# EAGLE schematic universal atmega16 (EAGLE 5.04)
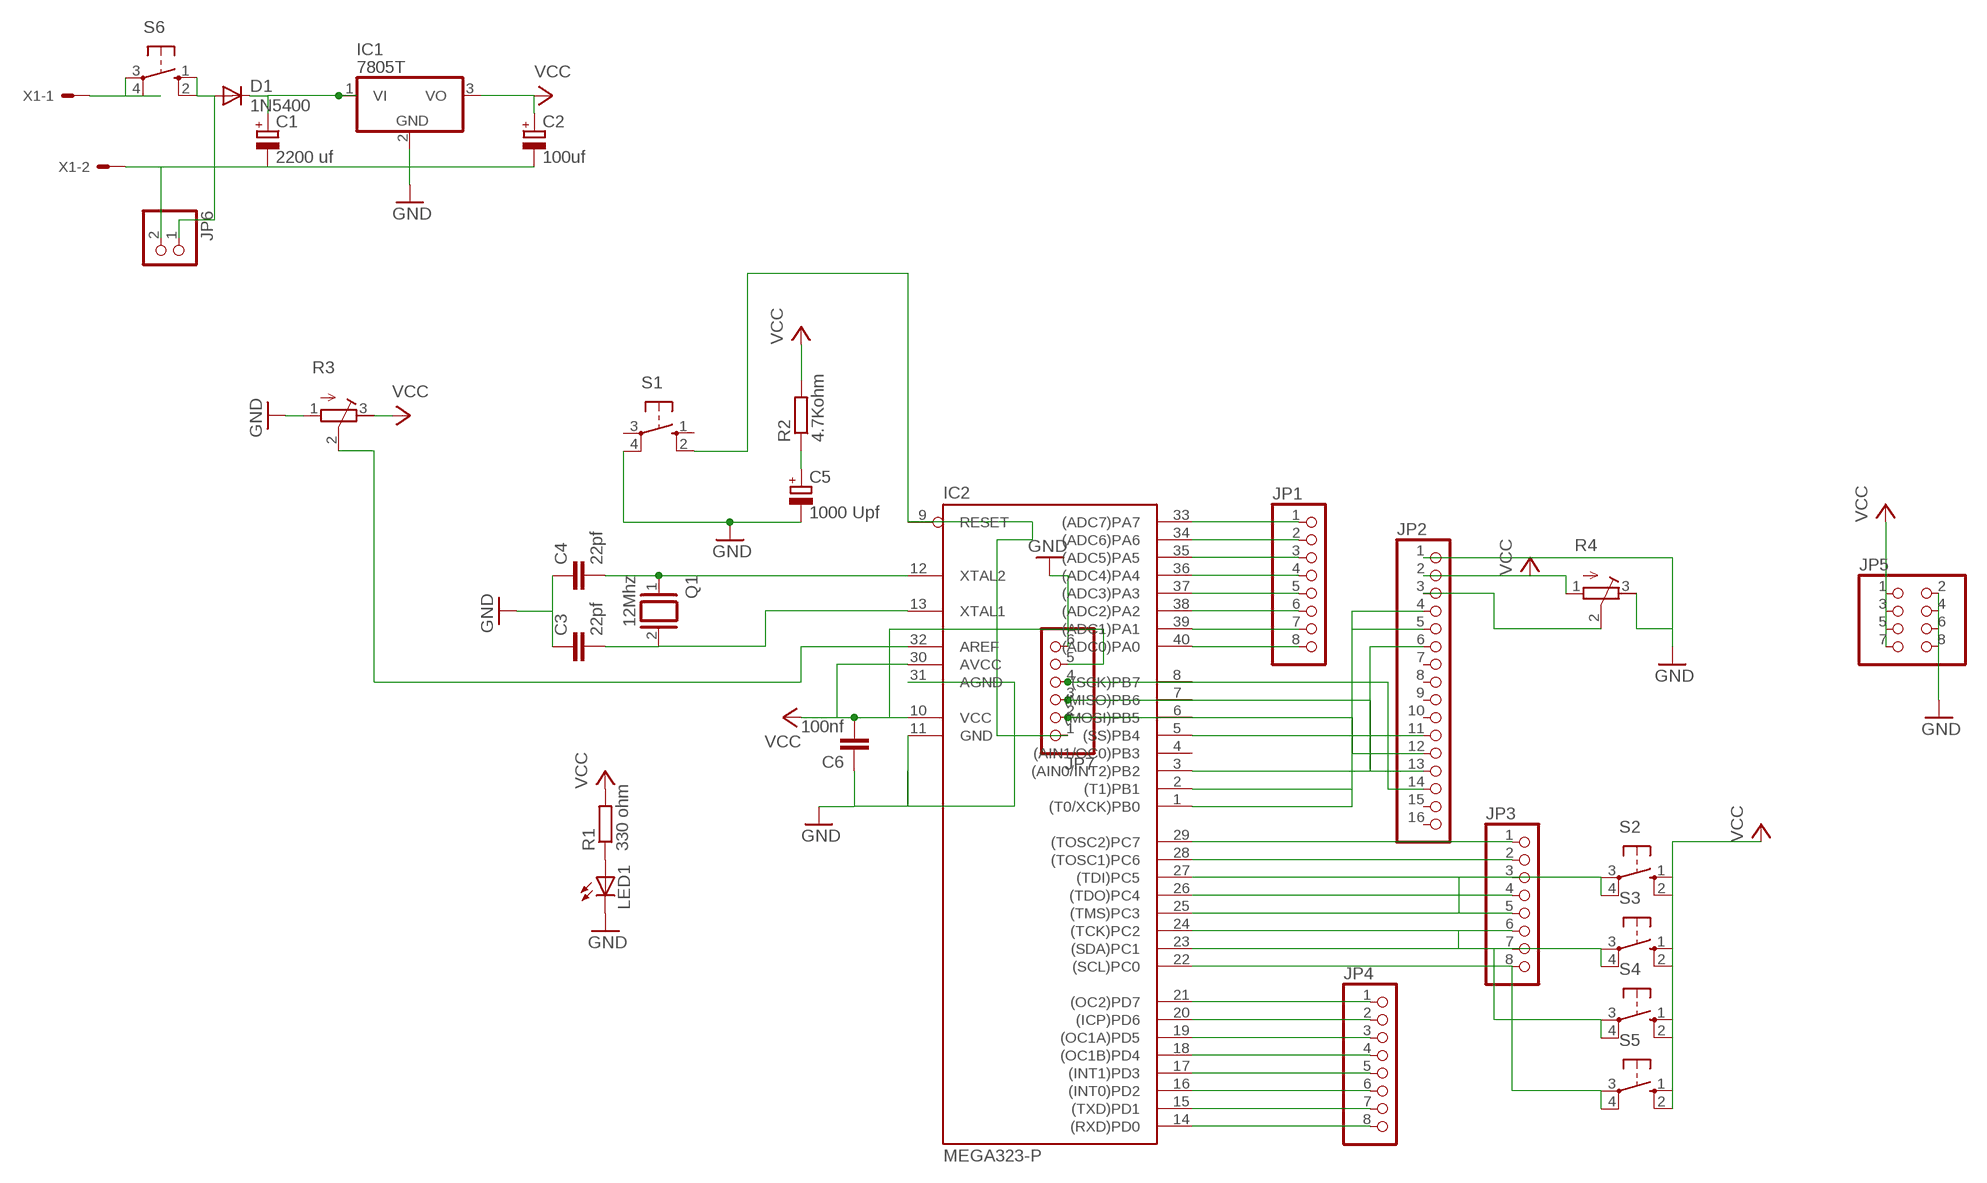
[diagram p0: schematic, sheet 1]

## Parts
C1  2200 uf  CPOL-EUE5-13  [E5-13]
C2  100uf  CPOL-EUE2-5  [E2-5]
C3  22pf  C-EU025-040X050  [C025-040X050]
C4  22pf  C-EU025-040X050  [C025-040X050]
C5  1000 Upf  CPOL-EUE3.5-10  [E3,5-10]
C6  100nf  C-EU025-040X050  [C025-040X050]
D1  1N5400  [DO201-15]
IC1  7805T  [TO220H]
IC2  MEGA323-P  [DIL40]
JP1  PINHD-1X8  [1X08]
JP2  PINHD-1X16  [1X16]
JP3  PINHD-1X8  [1X08]
JP4  PINHD-1X8  [1X08]
JP5  PINHD-2X4  [2X04]
JP6  PINHD-1X2  [1X02]
JP7  PINHD-1X6  [1X06]
LED1  LED3MM  [LED3MM]
Q1  12Mhz  XTAL/S  [QS]
R1  330 ohm  R-EU_0207/7  [0207/7]
R2  4.7Kohm  R-EU_0204/5  [0204/5]
R3  R-TRIMM3339P  [RTRIM3339P]
R4  R-TRIMM3339P  [RTRIM3339P]
S1  10-XX  [B3F-10XX]
S2  10-XX  [B3F-10XX]
S3  10-XX  [B3F-10XX]
S4  10-XX  [B3F-10XX]
S5  10-XX  [B3F-10XX]
S6  10-XX  [B3F-10XX]
X1  KK-156-2  [KK-156-2]

## Nets
GND: C1.- C2.- C3.1 C4.1 C5.- C6.1 IC1.2(GND) IC2.11(GND) IC2.31(AGND) JP2.1 JP5.2 JP5.4 JP5.6 JP5.8 JP6.2 JP7.6 LED1.K(C) R3.1(E) R4.3(A) S1.4(P1) X1.2
N$1: IC2.6((MOSI)PB5) JP2.12 JP7.2
N$2: C1.+ D1.C IC1.1(VI)
N$3: IC2.7((MISO)PB6) JP2.13 JP7.3
N$4: C4.2 IC2.12(XTAL2) Q1.1
N$5: IC2.5((SS)PB4) JP2.11
N$6: LED1.A R1.1
N$7: D1.A JP6.1 S6.1(S) S6.2(S1)
N$8: C5.+ R2.1
N$9: IC2.9(RESET) JP7.1 S1.2(S1)
N$10: IC2.8((SCK)PB7) JP2.14 JP7.4
N$11: IC2.33((ADC7)PA7) JP1.1
N$12: IC2.34((ADC6)PA6) JP1.2
N$13: IC2.35((ADC5)PA5) JP1.3
N$14: IC2.36((ADC4)PA4) JP1.4
N$15: IC2.37((ADC3)PA3) JP1.5
N$16: IC2.38((ADC2)PA2) JP1.6
N$17: IC2.39((ADC1)PA1) JP1.7
N$18: IC2.40((ADC0)PA0) JP1.8
N$19: IC2.3((AIN0/INT2)PB2) JP2.6
N$20: IC2.2((T1)PB1) JP2.5
N$21: IC2.1((T0/XCK)PB0) JP2.4
N$22: JP2.3 R4.2(S)
N$23: IC2.25((TMS)PC3) JP3.5 S2.3(P) S2.4(P1)
N$24: IC2.24((TCK)PC2) JP3.6 S3.3(P) S3.4(P1)
N$25: IC2.23((SDA)PC1) JP3.7 S4.3(P) S4.4(P1)
N$26: IC2.22((SCL)PC0) JP3.8 S5.3(P) S5.4(P1)
N$27: IC2.29((TOSC2)PC7) JP3.1
N$28: IC2.28((TOSC1)PC6) JP3.2
N$29: IC2.27((TDI)PC5) JP3.3
N$30: IC2.26((TDO)PC4) JP3.4
N$31: S6.3(P) S6.4(P1) X1.1
N$35: IC2.21((OC2)PD7) JP4.1
N$36: IC2.20((ICP)PD6) JP4.2
N$37: IC2.19((OC1A)PD5) JP4.3
N$38: IC2.18((OC1B)PD4) JP4.4
N$39: IC2.17((INT1)PD3) JP4.5
N$40: IC2.16((INT0)PD2) JP4.6
N$41: IC2.15((TXD)PD1) JP4.7
N$42: IC2.14((RXD)PD0) JP4.8
N$44: IC2.32(AREF) R3.2(S)
N$45: C3.2 IC2.13(XTAL1) Q1.2
VCC: C2.+ C6.2 IC1.3(VO) IC2.10(VCC) IC2.30(AVCC) JP2.2 JP5.1 JP5.3 JP5.5 JP5.7 JP7.5 R1.2 R2.2 R3.3(A) R4.1(E) S2.1(S) S2.2(S1) S3.1(S) S3.2(S1) S4.1(S) S4.2(S1) S5.1(S) S5.2(S1)
Unconnected: IC2.4((AIN1/OC0)PB3) JP2.7 JP2.8 JP2.9 JP2.10 JP2.15 JP2.16 S1.1(S) S1.3(P)

## Library data of the parts
C1 C2 C5 = rcl:CPOL-EU: POLARIZED CAPACITOR, European symbol
C3 C4 C6 = rcl:C-EU: CAPACITOR, European symbol
D1 = diode:1N5400: DIODE standard rectifier, 3 A, 50 V (Motorola)
IC1 = linear:78*: Positive VOLTAGE REGULATOR Source: http://cache.national.com/ds/LM/LM78L05.pdf http://www.fairchildsemi.com/ds/LM/LM7805.pdf
IC2 = atmel:MEGA323-P: MICROCONTROLLER 32 Kbytes FLASH 2 Kbytes SRAM 1 Kbytes EEPROM USART 8-channel 10 bit ADC Source: avr.lbr
JP1 JP3 JP4 = pinhead:PINHD-1X8: PIN HEADER
JP2 = pinhead:PINHD-1X16: PIN HEADER
JP5 = pinhead:PINHD-2X4: PIN HEADER
JP6 = pinhead:PINHD-1X2: PIN HEADER
JP7 = pinhead:PINHD-1X6: PIN HEADER
LED1 = led:LED: LED OSRAM: - CHIPLED LG R971, LG N971, LY N971, LG Q971, LY Q971, LO R971, LY R971 LH N974, LH R974 LS Q976, LO Q976, LY Q976 LO Q996 - Hyper CHIPLED LW Q18S LB Q993, LB Q99A, LB R99A - SideLED LS A670, LO A670, LY A670, LG A670, LP A670 LB A673, LV A673, LT A673, LW A673 LH A674 LY A675 LS A676, LA A676, LO A676, LY A676, LW A676 LS A679, LY A679, LG A679 - Hyper Micro SIDELED® LS Y876, LA Y876, LO Y876, LY Y876 LT Y87S - SmartLED LW L88C, LW L88S LB L89C, LB L89S, LG L890 LS L89K, LO L89K, LY L89K LS L896, LA L896, LO L896, LY L896 - TOPLED LS T670, LO T670, LY T670, LG T670, LP T670 LSG T670, LSP T670, LSY T670, LOP T670, LYG T670 LG T671, LOG T671, LSG T671 LB T673, LV T673, LT T673, LW T673 LH T674 LS T676, LA T676, LO T676, LY T676, LB T676, LH T676, LSB T676, LW T676 LB T67C, LV T67C, LT T67C, LS T67K, LO T67K, LY T67K, LW E67C LS E67B, LA E67B, LO E67B, LY E67B, LB E67C, LV E67C, LT E67C LW T67C LS T679, LY T679, LG T679 LS T770, LO T770, LY T770, LG T770, LP T770 LB T773, LV T773, LT T773, LW T773 LH T774 LS E675, LA E675, LY E675, LS T675 LS T776, LA T776, LO T776, LY T776, LB T776 LHGB T686 LT T68C, LB T68C - Hyper Mini TOPLED® LB M676 - Mini TOPLED Santana® LG M470 LS M47K, LO M47K, LY M47K Source: http://www.osram.convergy.de LUXEON: - LUMILED® LXK2-PW12-R00, LXK2-PW12-S00, LXK2-PW14-U00, LXK2-PW14-V00 LXK2-PM12-R00, LXK2-PM12-S00, LXK2-PM14-U00 LXK2-PE12-Q00, LXK2-PE12-R00, LXK2-PE12-S00, LXK2-PE14-T00, LXK2-PE14-U00 LXK2-PB12-K00, LXK2-PB12-L00, LXK2-PB12-M00, LXK2-PB14-N00, LXK2-PB14-P00, LXK2-PB14-Q00 LXK2-PR12-L00, LXK2-PR12-M00, LXK2-PR14-Q00, LXK2-PR14-R00 LXK2-PD12-Q00, LXK2-PD12-R00, LXK2-PD12-S00 LXK2-PH12-R00, LXK2-PH12-S00 LXK2-PL12-P00, LXK2-PL12-Q00, LXK2-PL12-R00 Source: www.luxeon.com KINGBRIGHT: KA-3528ASYC Source: www.kingbright.com
Q1 = special:XTAL/S: CRYSTAL
R1 R2 = rcl:R-EU_: RESISTOR, European symbol
R3 R4 = rcl:R-TRIMM: Trimm resistor
S1-S6 = switch-omron:10-XX: OMRON SWITCH
X1 = con-molex:KK-156-2: KK 156 HEADER Source: http://www.molex.com/pdm_docs/sd/026604100_sd.pdf